# EAGLE design ssrv2 (EAGLE 5.06)
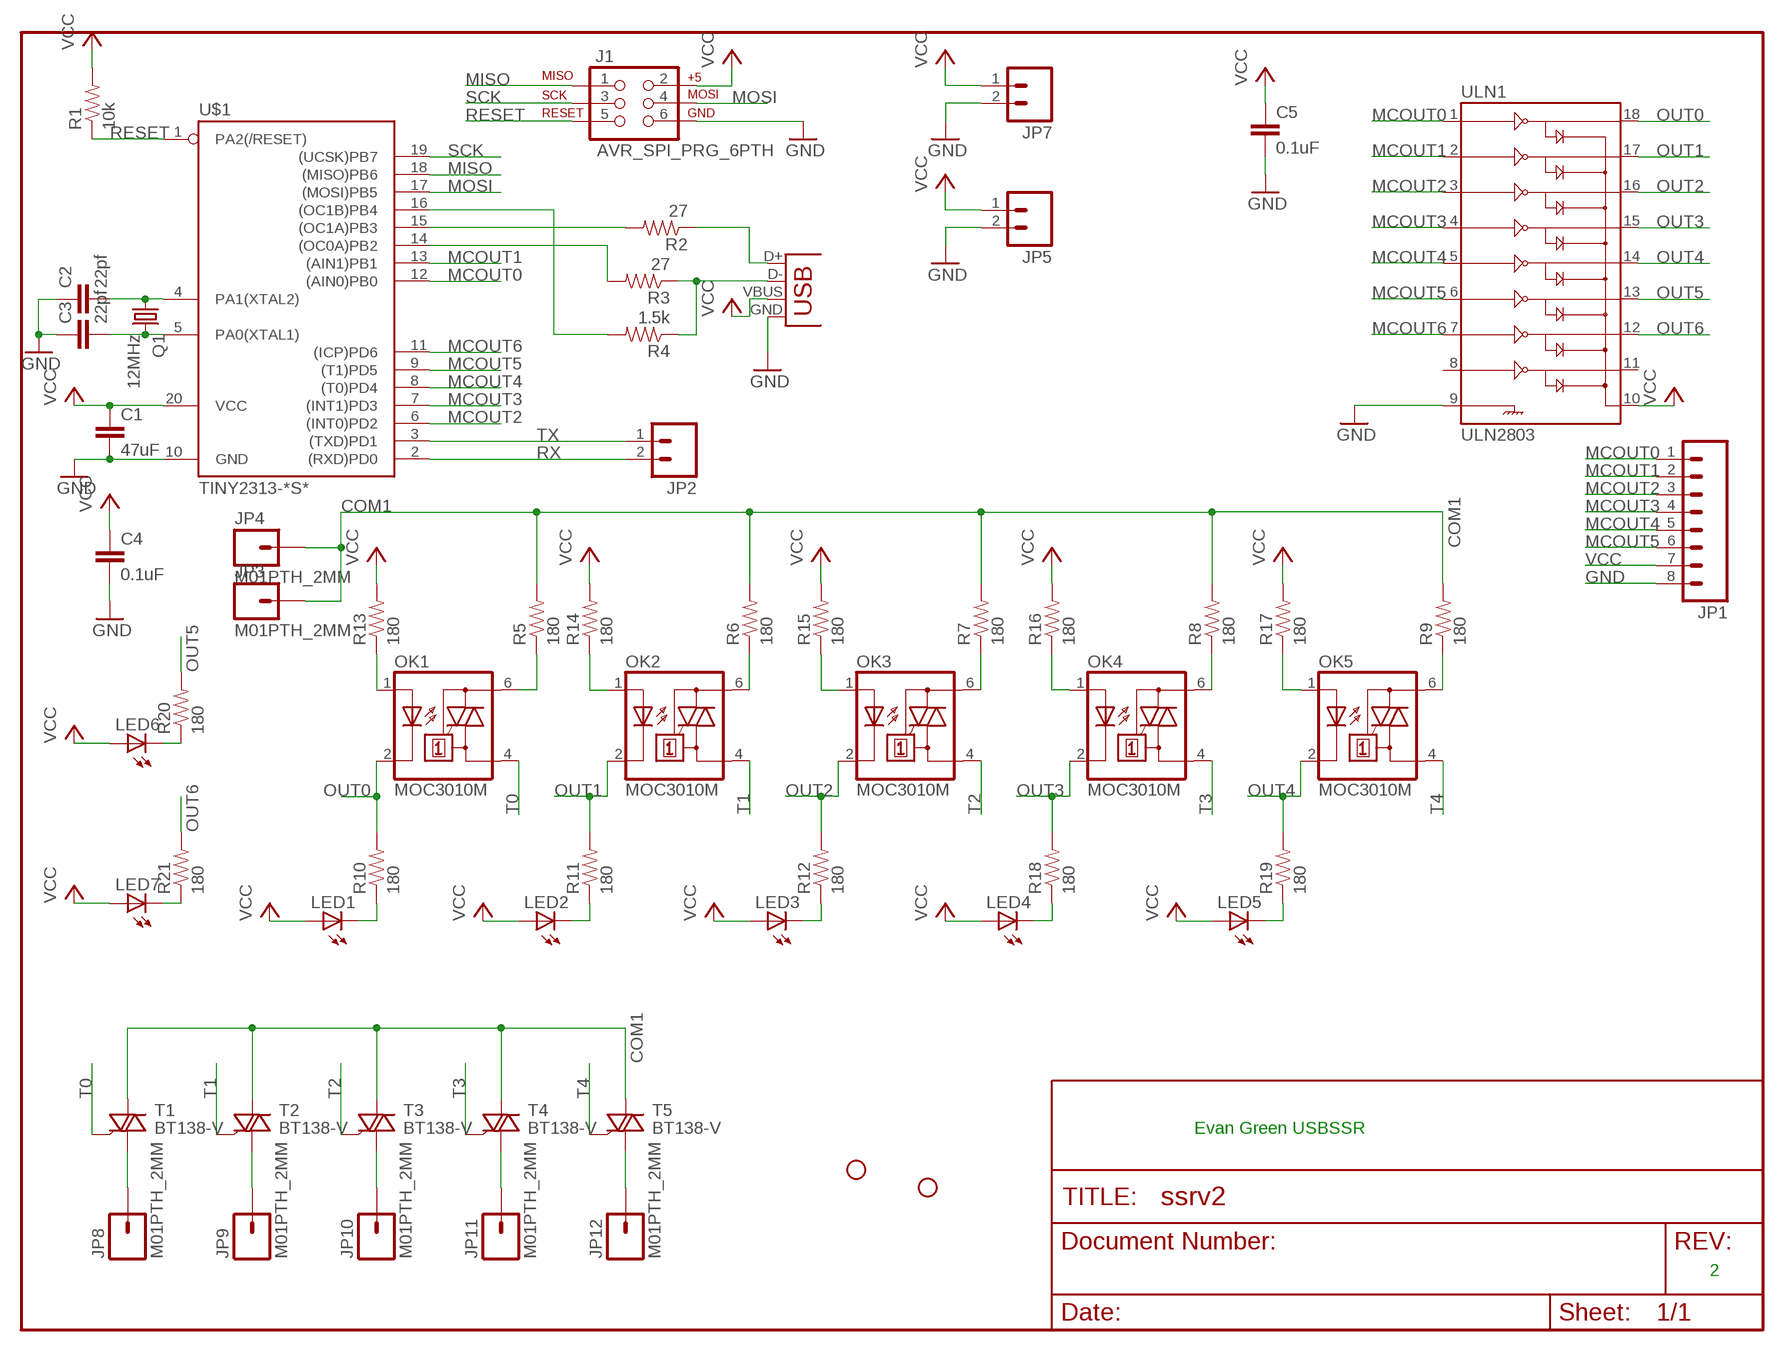
[diagram p0: schematic, sheet 1]

## Parts
C1  47uF  CAP1210  [1210]
C2  22pf  CAP0402-CAP  [0402-CAP]
C3  22pf  CAP0402-CAP  [0402-CAP]
C4  0.1uF  CAP0402-CAP  [0402-CAP]
C5  0.1uF  CAP0402-CAP  [0402-CAP]
J1  AVR_SPI_PRG_6PTH  [2X3]
JP1  M08LOCK  [1X08_LOCK]
JP2  M02PTH  [1X02]
JP3  M01PTH_2MM  [1X01_2MM]
JP4  M01PTH_2MM  [1X01_2MM]
JP5  M02PTH  [1X02]
JP6  STAND-OFF  [STAND-OFF]
JP7  M02PTH  [1X02]
JP8  M01PTH_2MM  [1X01_2MM]
JP9  M01PTH_2MM  [1X01_2MM]
JP10  M01PTH_2MM  [1X01_2MM]
JP11  M01PTH_2MM  [1X01_2MM]
JP12  M01PTH_2MM  [1X01_2MM]
JP13  STAND-OFF  [STAND-OFF]
LED1  LED1206  [LED-1206]
LED2  LED1206  [LED-1206]
LED3  LED1206  [LED-1206]
LED4  LED1206  [LED-1206]
LED5  LED1206  [LED-1206]
LED6  LED1206  [LED-1206]
LED7  LED1206  [LED-1206]
OK1  MOC3010M  [DIL06]
OK2  MOC3010M  [DIL06]
OK3  MOC3010M  [DIL06]
OK4  MOC3010M  [DIL06]
OK5  MOC3010M  [DIL06]
Q1  12MHz  CRYSTALTC38H  [TC38H]
R1  10k  RESISTOR0402-RES  [0402-RES]
R2  27  RESISTOR0402-RES  [0402-RES]
R3  27  RESISTOR0402-RES  [0402-RES]
R4  1.5k  RESISTOR0402-RES  [0402-RES]
R5  180  RESISTORPTH1  [AXIAL-0.3]
R6  180  RESISTORPTH1  [AXIAL-0.3]
R7  180  RESISTORPTH1  [AXIAL-0.3]
R8  180  RESISTORPTH1  [AXIAL-0.3]
R9  180  RESISTORPTH1  [AXIAL-0.3]
R10  180  RESISTOR0402-RES  [0402-RES]
R11  180  RESISTOR0402-RES  [0402-RES]
R12  180  RESISTOR0402-RES  [0402-RES]
R13  180  RESISTOR0402-RES  [0402-RES]
R14  180  RESISTOR0402-RES  [0402-RES]
R15  180  RESISTOR0402-RES  [0402-RES]
R16  180  RESISTOR0402-RES  [0402-RES]
R17  180  RESISTOR0402-RES  [0402-RES]
R18  180  RESISTOR0402-RES  [0402-RES]
R19  180  RESISTOR0402-RES  [0402-RES]
R20  180  RESISTOR0402-RES  [0402-RES]
R21  180  RESISTOR0402-RES  [0402-RES]
T1  BT138-V  [TO220BV]
T2  BT138-V  [TO220BV]
T3  BT138-V  [TO220BV]
T4  BT138-V  [TO220BV]
T5  BT138-V  [TO220BV]
U$1  TINY2313-*S*  [SO20L$]
ULN1  ULN2803  ULN2803SOICW  [SO18L]
X1  USBSMD  [USB-MINIB]

## Nets
COM1 [AC]: JP3.1 JP4.1 R5.P$2 R6.P$2 R7.P$2 R8.P$2 R9.P$2 T1.T2(A2) T2.T2(A2) T3.T2(A2) T4.T2(A2) T5.T2(A2)
GND: C1.2 C2.1 C3.1 C4.2 C5.2 J1.6 JP1.8 JP5.2 JP7.2 U$1.10(GND) ULN1.9 X1.GND
MCOUT0: JP1.1 U$1.12((AIN0)PB0) ULN1.1
MCOUT1: JP1.2 U$1.13((AIN1)PB1) ULN1.2
MCOUT2: JP1.3 U$1.6((INT0)PD2) ULN1.3
MCOUT3: JP1.4 U$1.7((INT1)PD3) ULN1.4
MCOUT4: JP1.5 U$1.8((T0)PD4) ULN1.5
MCOUT5: JP1.6 U$1.9((T1)PD5) ULN1.6
MCOUT6: U$1.11((ICP)PD6) ULN1.7
MISO: J1.1 U$1.18((MISO)PB6)
MOSI: J1.4 U$1.17((MOSI)PB5)
N$1: OK1.1(A) R13.1
N$2: OK2.1(A) R14.1
N$3: OK3.1(A) R15.1
N$4: OK4.1(A) R16.1
N$5: OK5.1(A) R17.1
N$6: LED5.C R19.1
N$7: LED4.C R18.1
N$8: LED3.C R12.1
N$9: OK1.6(A2) R5.P$1
N$10: OK2.6(A2) R6.P$1
N$11: OK3.6(A2) R7.P$1
N$12: OK4.6(A2) R8.P$1
N$13: OK5.6(A2) R9.P$1
N$14: LED2.C R11.1
N$15: LED1.C R10.1
N$17: R2.1 X1.D+
N$18: R2.2 U$1.15((OC1A)PB3)
N$19: R3.1 R4.1 X1.D-
N$20: R3.2 U$1.14((OC0A)PB2)
N$21 [AC]: JP8.1 T1.T1(A1)
N$22: R4.2 U$1.16((OC1B)PB4)
N$23 [AC]: JP9.1 T2.T1(A1)
N$24 [AC]: JP10.1 T3.T1(A1)
N$25 [AC]: JP11.1 T4.T1(A1)
N$26 [AC]: JP12.1 T5.T1(A1)
N$27: LED6.C R20.1
N$29: LED7.C R21.1
N$38: C2.2 Q1.1 U$1.4(PA1(XTAL2))
N$39: C3.2 Q1.2 U$1.5(PA0(XTAL1))
OUT0: OK1.2(C) R10.2 ULN1.18
OUT1: OK2.2(C) R11.2 ULN1.17
OUT2: OK3.2(C) R12.2 ULN1.16
OUT3: OK4.2(C) R18.2 ULN1.15
OUT4: OK5.2(C) R19.2 ULN1.14
OUT5: R20.2 ULN1.13
OUT6: R21.2 ULN1.12
RESET: J1.5 R1.1 U$1.1(PA2(/RESET))
RX: JP2.2 U$1.2((RXD)PD0)
SCK: J1.3 U$1.19((UCSK)PB7)
T0: OK1.4(A1) T1.G
T1: OK2.4(A1) T2.G
T2: OK3.4(A1) T3.G
T3: OK4.4(A1) T4.G
T4: OK5.4(A1) T5.G
TX: JP2.1 U$1.3((TXD)PD1)
VCC: C1.1 C4.1 C5.1 J1.2 JP1.7 JP5.1 JP7.1 LED1.A LED2.A LED3.A LED4.A LED5.A LED6.A LED7.A R1.2 R13.2 R14.2 R15.2 R16.2 R17.2 U$1.20(VCC) ULN1.10 X1.VBUS
Unconnected: ULN1.8 ULN1.11

## Notes on the sheet
- Evan Green USBSSR
- 2

## Library data of the parts
C1-C5 = SparkFun:CAP: Capacitor Standard 0603 ceramic capacitor, and 0.1" leaded capacitor.
J1 = SparkFun:AVR_SPI_PRG_6: AVR ISP 6 Pin This is the reduced ISP connector for AVR programming. Common on Arduino. This footprint will take up less PCB space and can be used with a 10-pin to 6-pin adapter such as SKU: BOB-08508
JP1 = SparkFun:M08: Header 8 Standard 8-pin 0.1" header. Use with straight break away headers (SKU : PRT-00116), right angle break away headers (PRT-00553), swiss pins (PRT-00743), machine pins (PRT-00117), and female headers (PRT-00115).
JP2 JP5 JP7 = SparkFun:M02: Header 2 Standard 2-pin 0.1" header. Use with straight break away headers (SKU : PRT-00116), right angle break away headers (PRT-00553), swiss pins (PRT-00743), machine pins (PRT-00117), and female headers (PRT-00115). Molex polarized connector foot print use with SKU : PRT-08233 with associated crimp pins and housings.
JP3 JP4 JP8-JP12 = SparkFun:M01: Header 1 Standard 1-pin 0.1" header. Use with straight break away headers (SKU : PRT-00116), right angle break away headers (PRT-00553), swiss pins (PRT-00743), machine pins (PRT-00117), and female headers (PRT-00115).
JP6 JP13 = SparkFun:STAND-OFF: Stand Off This is the mechanical footprint for a #4 phillips button head screw. Use the keepout ring to avoid running the screw head into surrounding components. SKU : PRT-00447
LED1-LED7 = SparkFun:LED: LEDs Standard schematic elements and footprints for 5mm, 3mm, 1206, and 0603 sized LEDs. 5mm - Spark Fun Electronics SKU : COM-00529 (and others)
OK1-OK5 = optocoupler:MOC30*M: RANDOM-PHASE OPTOISOLATORS TRIAC DRIVER OUTPUT Source: http://www.fairchildsemi.com MOC3020-M.pdf
Q1 = SparkFun:CRYSTAL: Crystals Various standard crystals. Proven footprints. Spark Fun Electronics SKU : COM-00534
R1-R21 = SparkFun:RESISTOR: Resistor Basic schematic elements and footprints for 0603, 1206, and PTH 1/10th watt (small) resistors.
T1-T5 = triac:BT138: TRIAC Source: http://www.semiconductors.philips.com BT138_SERIES_2.pdf
U$1 = avr-6:TINY2313*: Atmel Tiny2313 2K Flash, 128 bytes EEPROM, 128 bytes RAM
ULN1 = SparkFun:ULN2803: Darlington Driver ULN2803 Darlington array. 500mA max per channel, 8-channel package. Spark Fun Electronics SKU : COM-00312
X1 = SparkFun:USB: USB Connectors USB-B-PTH is fully proven SKU : PRT-00139 USB-miniB is fully proven SKU : PRT-00587 USB-A-PCB is untested. USB-A-H is throughly reviewed, but untested. Spark Fun Electronics SKU : PRT-00437 USB-B-SMT is throughly reviewed, but untested. Needs silkscreen touching up. USB-A-S has not been used/tested USB-MB-H has not been used/tested

## Net classes
0 default: width 0.305 mm, clearance 0.203 mm
1 AC: width 1.524 mm, clearance 0.508 mm

## Board
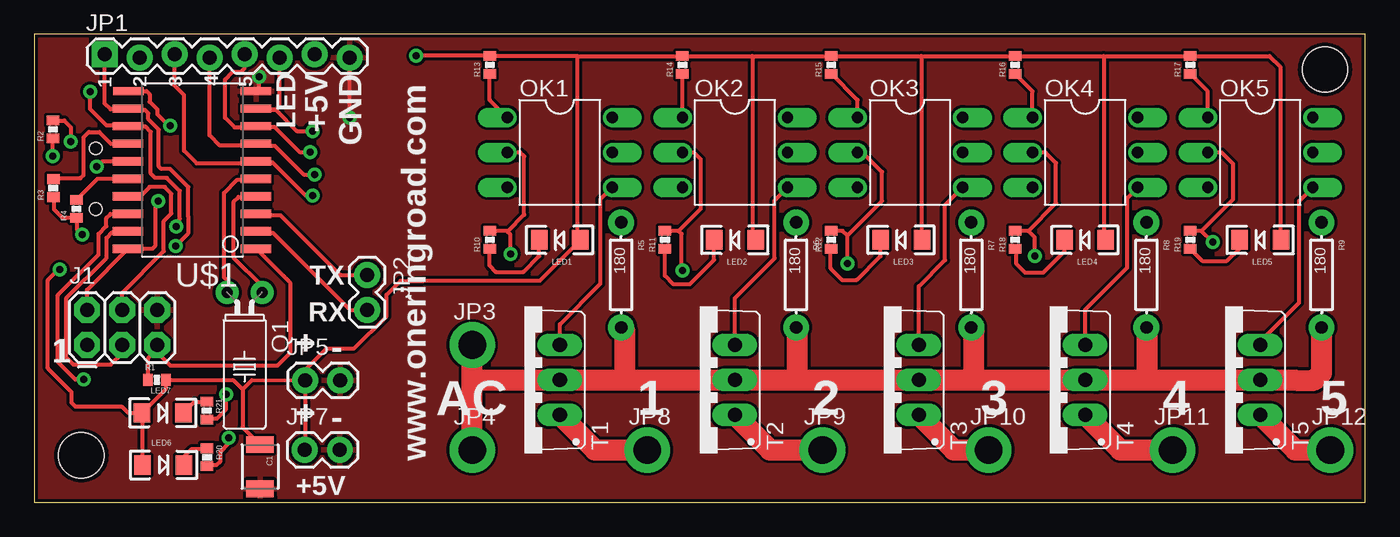
[diagram p1: board, top side]
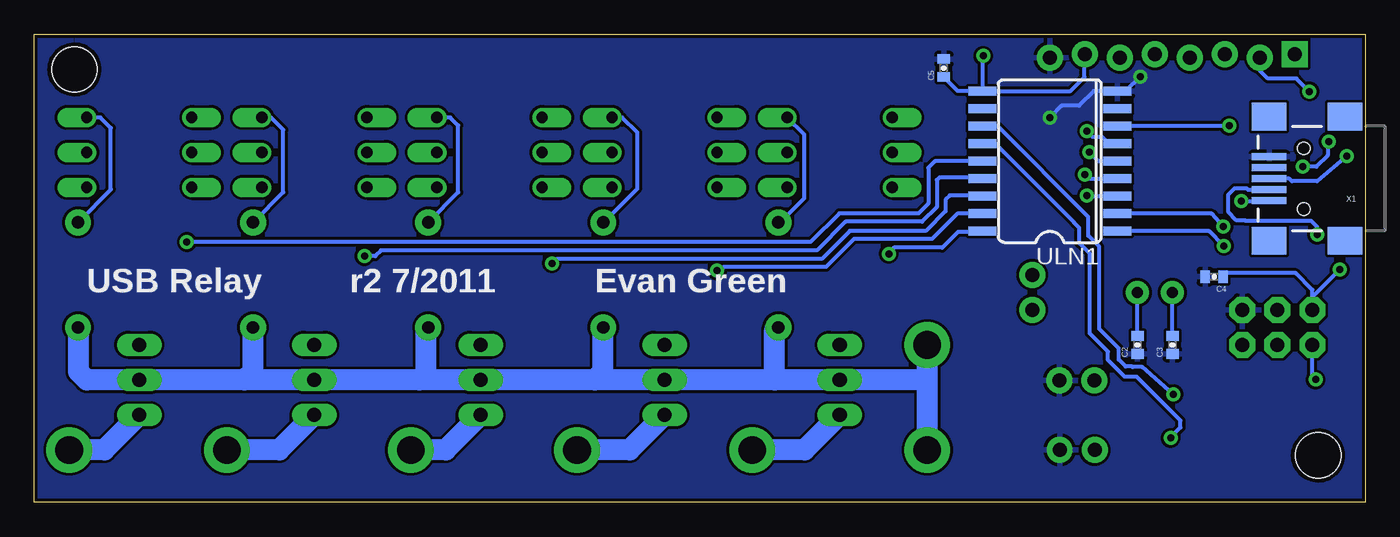
[diagram p2: board, bottom side, seen from below]

Size 96.5 x 33.96 mm. Coordinates in mm from the lower left corner, seen from the top.
Outline: 0,0 96.5,0 96.5,33.96 0,33.96 0,0
Copper layers (1*16): Top 0.035mm / dielectric 1.5mm / Bottom 0.035mm
Design rules "SparkFun": minimum track width 8mil, minimum drill 20mil, track to track 8mil, track to pad 8mil, pad to pad 8mil, via to via 8mil, smd to smd 8mil, copper to edge 10mil, drill to drill 8mil, minimum pad ring 12mil, minimum via ring 10mil, stop-mask expansion 4mil, vias tented up to drill 25mil, thermal gap 10mil

### Footprints (pad centres in the part's own frame; a part is rotated, then mirrored left to right if it is on the bottom)
1210 = smd 1.2 x 2: 1 -1.6,0; 2 1.6,0
0402-CAP = smd 0.7 x 0.9: 1 -0.65,0; 2 0.65,0
2X3 = drill 1.016 pad 1.88 octagon: 1 0,0; 2 0,2.54; 3 2.54,0; 4 2.54,2.54; 5 5.08,0; 6 5.08,2.54
1X08_LOCK = drill 1.016 pad 1.88 square: 1 0,0.127 | drill 1.016 pad 1.88 round: 2 2.54,-0.127; 3 5.08,0.127; 4 7.62,-0.127; 5 10.16,0.127; 6 12.7,-0.127; 7 15.24,0.127; 8 17.78,-0.127
1X02 = drill 1.016 pad 1.88 round: 1 0,0; 2 2.54,0
1X01_2MM = drill 2 pad 3.302 round: 1 0,0
STAND-OFF = hole 3.302: 0,0
LED-1206 = smd 1.2 x 1.4: A -1.5,0; C 1.5,0
DIL06 = drill 0.813 offset: 1 -2.54,-3.81; 2 0,-3.81; 3 2.54,-3.81; 4 2.54,3.81; 5 0,3.81; 6 -2.54,3.81
TC38H = drill 0.813 pad 1.676 round: 1 -1.27,0; 2 1.27,0
0402-RES = smd 0.7 x 0.9: 1 -0.65,0; 2 0.65,0
AXIAL-0.3 = drill 0.9 pad 1.88 round: P$1 -3.81,0; P$2 3.81,0
TO220BV = drill 1.016 long: G 2.54,-2.54; T1 -2.54,-2.54; T2 0,-2.54
SO20L$ = smd 0.61 x 2.21: 1 -5.715,-4.636; 2 -4.445,-4.636; 3 -3.175,-4.636; 4 -1.905,-4.636; 5 -0.635,-4.636; 6 0.635,-4.636; 7 1.905,-4.636; 8 3.175,-4.636; 9 4.445,-4.636; 10 5.715,-4.636; 11 5.715,4.61; 12 4.445,4.636; 13 3.175,4.636; 14 1.905,4.636; 15 0.635,4.636; 16 -0.635,4.636; 17 -1.905,4.636; 18 -3.175,4.636; 19 -4.445,4.636; 20 -5.715,4.636
SO18L = smd 0.66 x 2.032: 1 -0.635,-4.902; 2 0.635,-4.902; 3 1.905,-4.902; 4 3.175,-4.902; 5 4.445,-4.902; 6 5.715,-4.902; 7 6.985,-4.902; 8 8.255,-4.902; 9 9.525,-4.902; 10 9.525,4.902; 11 8.255,4.902; 12 6.985,4.902; 13 5.715,4.902; 14 4.445,4.902; 15 3.175,4.902; 16 1.905,4.902; 17 0.635,4.902; 18 -0.635,4.902
USB-MINIB = smd 2.5 x 0.5: D+ 2.5,0; D- 2.5,0.8; GND 2.5,-1.6; ID 2.5,-0.8; VBUS 2.5,1.6 | smd 2.5 x 2: GND@1 -3,-4.5; GND@2 -3,4.5; GND@3 2.5,4.5; GND@4 2.5,-4.5 | hole 0.9: 0,2.2; 0,-2.2

### Placement (x,y rotation side)
C1  16.36,2.59 270 top
C2  16.51,11.43 90 bottom
C3  13.97,11.43 90 bottom
C4  10.95,16.38 180 bottom
C5  30.56,31.52 90 bottom
J1  3.81,11.43 0 top
JP1  5.08,32.38 0 top
JP2  24.13,16.51 270 top
JP3  31.75,11.43 0 top
JP4  31.75,3.81 0 top
JP5  19.63,8.86 0 top
JP6  3.4,3.4 0 top
JP7  19.61,3.81 0 top
JP8  44.45,3.81 0 top
JP9  57.15,3.81 0 top
JP10  69.22,3.81 0 top
JP11  82.55,3.81 0 top
JP12  93.98,3.81 0 top
JP13  93.6,31.42 0 top
LED1  38.1,19.05 180 top
LED2  50.8,19.05 180 top
LED3  62.87,19.05 180 top
LED4  76.2,19.05 180 top
LED5  88.9,19.05 180 top
LED6  9.35,2.72 0 top
LED7  9.3,6.5 0 top
OK1  38.1,25.4 270 top
OK2  50.8,25.4 270 top
OK3  63.5,25.4 270 top
OK4  76.2,25.4 270 top
OK5  88.9,25.4 270 top
Q1  15.24,15.24 180 top
R1  8.89,8.89 0 top
R2  1.35,27.08 90 top
R3  1.37,22.81 90 top
R4  3.05,21.31 90 top
R5  42.55,16.51 270 top
R6  55.24,16.51 270 top
R7  67.94,16.51 270 top
R8  80.64,16.51 270 top
R9  93.34,16.51 270 top
R10  33.02,19.05 90 top
R11  45.72,19.05 90 top
R12  57.78,19.05 90 top
R13  33.02,31.75 90 top
R14  46.99,31.75 90 top
R15  57.78,31.75 90 top
R16  71.12,31.75 90 top
R17  83.82,31.75 90 top
R18  71.12,19.05 90 top
R19  83.82,19.05 90 top
R20  12.52,3.28 270 top
R21  12.5,6.65 270 top
T1  35.56,8.89 90 top
T2  48.26,8.89 90 top
T3  61.59,8.89 90 top
T4  73.66,8.89 90 top
T5  86.36,8.89 90 top
U$1  11.43,24.13 90 top
ULN1  22.86,20.32 90 bottom
X1  4.45,23.5 180 bottom

### Tracks (layer width: path | path; a pad name or v marks a point on that pad's centre or on a via)
COM1
  Top 1.524: JP4.1 31.75,8.89 | 31.75,8.89 JP3.1 | 31.75,8.89 T1.T2 42.82,8.89 | 42.82,8.89 T2.T2 55.35,8.89 | 55.35,8.89 T3.T2 68.15,8.89 | 68.15,8.89 T4.T2 80.72,8.89 | 80.72,8.89 T5.T2 91.44,8.89 91.47,8.87 92.81,8.87 93.34,9.4 R9.P$2 | R8.P$2 80.72,12.62 80.72,8.89 | R7.P$2 68.15,12.5 68.15,8.89 | R6.P$2 55.35,12.6 55.35,8.89 | R5.P$2 42.82,12.42 42.82,8.89
  Bottom 1.524: JP4.1 31.75,8.89 | 31.75,8.89 JP3.1 | 31.75,8.89 42.82,8.89 | 42.82,8.89 55.88,8.89 | 55.88,8.89 68.58,8.89 | 68.58,8.89 81.28,8.89 | 81.28,8.89 92.71,8.89 93.29,9.47 93.29,12.65 | 42.82,8.89 42.82,12.52 | 55.88,8.89 55.27,9.5 55.27,12.62 | 68.58,8.89 68.1,9.37 68.1,12.72 | 81.28,8.89 80.64,9.53 80.64,12.62
GND  (via drill 0.51)
  Top 0.305: U$1.10 16.31,30.09 v16.31,30.91 | v22.86,27.94 JP1.8
  Bottom 0.305: v16.31,30.91 17.37,29.84 ULN1.9 19.68,29.84 20.75,28.78 22.02,28.78 v22.86,27.94
  pour Top: 0,0 96.52,0 96.52,34.29 0,34.29
  pour Bottom: 0,0 96.52,0 96.52,34.29 0,34.29
MCOUT0  (via drill 0.51)
  Top 0.305: JP1.1 5.08,28.96 5.51,28.52 6.74,28.52 U$1.12 6.9,28.47 8.03,28.47 8.26,28.25 8.26,27.81 9.02,27.05 9.02,24.38 9.2,24.21 9.83,24.21 11.15,22.89 11.15,20.73 11.18,20.7 11.18,19.56 v10.24,18.62
  Bottom 0.305: v10.24,18.62 11.3,19.68 ULN1.1
MCOUT1  (via drill 0.51)
  Top 0.305: v4.04,29.82 4.04,28.55 5.23,27.36 6.74,27.36 U$1.13 6.84,27.25 8.05,27.25 8.43,26.87 8.43,23.85 8.74,23.55 9.6,23.55 10.54,22.61 10.54,20.57 10.19,20.22 v10.26,20.02
  Bottom 0.305: v4.04,29.82 4.98,30.76 7.04,30.76 7.62,31.34 JP1.2 | v10.26,20.02 11.12,20.95 ULN1.2
MCOUT2  (via drill 0.51)
  Top 0.305: v20.17,22.28 19.66,22.28 17.27,24.66 16.17,24.66 U$1.6 15.91,24.61 11.76,24.61 10.85,25.53 10.85,29.57 10.16,30.25 JP1.3
  Bottom 0.305: v20.17,22.28 20.12,22.23 ULN1.3
MCOUT3  (via drill 0.51)
  Top 0.305: v20.32,23.8 19.51,23.8 17.42,25.88 16.22,25.88 U$1.7 15.96,25.93 13.41,25.93 12.7,26.64 JP1.4
  Bottom 0.305: v20.32,23.8 20.02,23.5 ULN1.4
MCOUT4  (via drill 0.51)
  Top 0.305: v19.99,25.43 19.23,25.43 17.4,27.25 16.12,27.25 U$1.8 15.99,27.23 14.5,27.23 13.82,27.91 13.82,30.68 14.38,31.24 14.99,31.24 15.24,31.5 JP1.5
  Bottom 0.305: v19.99,25.43 19.33,24.77 ULN1.5
MCOUT5  (via drill 0.51)
  Top 0.305: v20.17,26.95 19.02,26.95 17.48,28.5 16.14,28.5 U$1.9 16.09,28.55 17.55,28.55 17.78,28.78 JP1.6
  Bottom 0.305: v20.17,26.95 19.76,26.54 19.07,26.54 18.57,26.04 ULN1.6
MCOUT6  (via drill 0.51)
  Top 0.305: U$1.11 8.13,29.84 8.36,29.62 8.36,29.08 8.91,28.52 8.91,28.17 9.7,27.38 v9.86,27.33
  Bottom 0.305: v9.86,27.33 9.75,27.3 ULN1.7
MISO  (via drill 0.51)
  Top 0.305: U$1.18 6.77,20.93 5.51,20.93 5.21,20.62 5.21,20.04 4.65,19.48 4.65,17.98 1.7,15.04 1.7,10.19 2.97,8.91 v3.58,8.91
  Bottom 0.305: v3.58,8.91 3.81,9.14 J1.1
MOSI
  Top 0.305: U$1.17 6.9,22.33 7.8,22.33 8.36,22.89 9.45,22.89 9.93,22.4 9.93,20.98 9.37,20.42 9.37,18.24 6.35,15.21 J1.4
N$1
  Top 0.305: OK1.1 33.02,29.21 R13.1
N$2
  Top 0.305: OK2.1 R14.1
N$3
  Top 0.305: R15.1 59.69,29.2 OK3.1
N$4
  Top 0.305: R16.1 72.39,29.83 OK4.1
N$5
  Top 0.305: R17.1 85.09,29.83 OK5.1
N$6
  Top 0.305: R19.1 84.69,17.53 86.49,17.53 87.4,18.44 LED5.C
N$7
  Top 0.305: R18.1 71.22,18.3 71.22,17.3 71.86,16.66 73.15,16.66 74.7,18.21 LED4.C
N$8
  Top 0.305: R12.1 57.73,18.35 57.73,16.99 58.57,16.15 59.64,16.15 61.37,17.88 LED3.C
N$9
  Bottom 0.305: OK1.6 40.66,26.7 40.66,22.07 42.42,20.32 R5.P$1
N$10
  Bottom 0.305: R6.P$1 52.78,22.78 52.78,26.85 53.87,27.94 OK2.6
N$11
  Bottom 0.305: R7.P$1 65.76,22.5 65.76,27.36 66.34,27.94 OK3.6
N$12
  Bottom 0.305: R8.P$1 78.46,22.5 78.46,27.05 79.35,27.94 OK4.6
N$13
  Bottom 0.305: R9.P$1 90.96,22.71 90.96,27.18 91.72,27.94 OK5.6
N$14
  Top 0.305: R11.1 45.72,16.46 46.35,15.82 47.52,15.82 49.3,17.6 LED2.C
N$15
  Top 0.305: R10.1 32.99,18.38 32.99,17.2 33.45,16.74 35.46,16.74 36.6,17.88 LED1.C
N$17  (via drill 0.51)
  Top 0.305: R2.1 1.32,26.4 v1.32,25.15
  Bottom 0.305: v1.32,25.15 3.48,23.32 5.31,23.32 5.49,23.5 X1.D+
N$18  (via drill 0.51)
  Top 0.305: R2.2 1.36,27.71 2.16,27.71 2.64,27.23 v2.64,26.19 | v4.52,24.36 4.93,24.77 U$1.15
  Bottom 0.305: v2.64,26.19 2.72,26.11 2.72,25.17 3.53,24.36 v4.52,24.36
N$19  (via drill 0.51)
  Top 0.305: R3.1 1.4,22.13 1.4,21.29 2.02,20.66 R4.1 3.07,20.64 3.07,19.81 3.45,19.43 v3.48,19.43
  Bottom 0.305: X1.D- 8.5,22.7 8.61,22.81 9.45,22.81 9.91,22.35 9.91,21.06 9.32,20.47 8.71,20.47 8.66,20.42 3.91,20.42 3.48,19.99 v3.48,19.43
N$20
  Top 0.305: R3.2 1.43,23.52 3.33,23.52 3.56,23.75 3.56,26.49 3.94,26.87 4.7,26.87 5.54,26.04 U$1.14
N$21
  Top 1.524: T1.T1 40.64,3.81 JP8.1
  Bottom 1.524: T1.T1 40.64,3.81 JP8.1
N$22
  Top 0.305: R4.2 4.58,23.5 U$1.16
N$23
  Top 1.524: T2.T1 53.34,3.81 JP9.1
  Bottom 1.524: T2.T1 53.34,3.81 JP9.1
N$24
  Top 1.524: T3.T1 66.67,3.81 JP10.1
  Bottom 1.524: T3.T1 66.67,3.81 69.85,3.81
N$25
  Top 1.524: T4.T1 78.74,3.81 JP11.1
  Bottom 1.524: T4.T1 78.74,3.81 JP11.1
N$26
  Top 1.524: T5.T1 91.44,3.81 JP12.1
  Bottom 1.524: T5.T1 91.44,3.81 JP12.1
N$27
  Top 0.305: R20.1 12.48,3.89 11.4,3.89 10.85,3.33 LED6.C
N$29
  Top 0.305: LED7.C 11.6,7.3 R21.1
N$38
  Top 0.305: U$1.4 16.02,22.17 14.81,22.17 14.45,21.82 14.45,17.75 16.51,15.7 Q1.1
  Bottom 0.305: C2.2 Q1.1
N$39
  Top 0.305: U$1.5 15.99,23.42 14.71,23.42 13.74,22.45 13.74,16.33 13.97,16.1 Q1.2
  Bottom 0.305: C3.2 Q1.2
OUT0  (via drill 0.51)
  Top 0.305: v34.54,18.03 34.52,18.06 34.52,19.43 34.25,19.7 | 34.25,19.7 R10.2 | OK1.2 35.23,25.4 35.51,25.12 35.51,20.88 34.33,19.7 34.25,19.7
  Bottom 0.305: ULN1.18 27.81,19.63 29.52,19.63 30.66,18.49 34.16,18.49 34.54,18.11 v34.54,18.03
OUT1  (via drill 0.51)
  Top 0.305: v46.99,16.82 46.94,16.87 46.94,19.48 46.72,19.7 | 46.72,19.7 R11.2 | 46.72,19.7 48.34,21.32 48.34,24.89 47.83,25.4 OK2.2
  Bottom 0.305: ULN1.17 29.57,20.95 31.39,19.13 37.06,19.13 39.09,17.09 46.51,17.09 46.79,16.82 v46.99,16.82
OUT2  (via drill 0.51)
  Top 0.305: v58.98,17.35 58.95,17.53 58.95,19.36 | 58.95,19.36 58.61,19.7 R12.2 | 58.95,19.36 61.47,21.87 61.47,23.98 60.05,25.4 OK3.2
  Bottom 0.305: ULN1.16 27.81,22.28 30.12,22.28 30.43,21.97 30.43,21.13 31.85,19.71 37.36,19.71 39.4,17.68 58.57,17.68 58.75,17.5 v58.98,17.35
OUT3  (via drill 0.51)
  Top 0.305: v72.57,17.88 72.54,17.91 72.54,19.23 72.07,19.7 | 72.07,19.7 R18.2 | 72.07,19.7 74.09,21.72 74.09,24.64 73.33,25.4 OK4.2
  Bottom 0.305: ULN1.15 27.84,23.57 30.89,23.57 31.06,23.39 31.06,21.44 32.13,20.37 37.67,20.37 39.75,18.29 71.37,18.29 71.78,17.88 v72.57,17.88
OUT4  (via drill 0.51)
  Top 0.305: v85.45,18.9 84.64,19.7 | 84.64,19.7 R19.2 | 84.64,19.7 86.94,22 86.94,24.56 86.11,25.4 OK5.2
  Bottom 0.305: ULN1.14 31.19,24.77 31.67,24.28 31.67,21.69 32.38,20.98 38.12,20.98 40.21,18.9 v85.45,18.9
OUT5  (via drill 0.51)
  Top 0.305: R20.2 12.61,2.72 13.21,2.72 13.49,3 13.49,3.68 14.1,4.29 v14.1,4.67
  Bottom 0.305: ULN1.13 26.8,26.04 21.11,20.34 21.11,20.3 20.73,19.91 20.73,18.82 19.96,18.06 19.96,12.27 18.64,10.95 18.64,10.34 17.42,9.12 16.56,9.12 13.39,5.94 13.39,5.44 14.1,4.72 v14.1,4.67
OUT6  (via drill 0.51)
  Top 0.305: R21.2 12.59,6.1 13.23,6.1 13.89,6.76 v13.89,7.85
  Bottom 0.305: ULN1.12 26.64,27.3 20.07,20.73 20.07,19.36 19.28,18.57 19.28,12.6 17.86,11.18 17.86,10.36 17.35,9.86 16.89,9.86 16.87,9.83 16.15,9.83 v13.89,7.85
RESET
  Top 0.305: U$1.1 18.57,15.91 18.57,10.87 17.63,9.93 9.86,9.93 8.89,10.9 | 8.89,10.9 J1.5 | R1.1 8.26,8.9 8.26,10.49 8.66,10.9 8.89,10.9
RX
  Top 0.305: U$1.2 16.17,19.58 17.27,19.58 22.89,13.97 JP2.2
SCK
  Top 0.305: U$1.19 6.72,19.61 5.64,19.61 5.23,19.2 5.23,17.75 2.31,14.83 2.31,10.52 2.82,10.01 5.54,10.01 6.35,10.82 J1.3
T0
  Top 0.305: OK1.4 41.05,22 41.05,15.88 38.1,12.93 T1.G
T1
  Top 0.305: OK2.4 53.67,21.92 53.67,17.7 50.8,14.83 T2.G
T2
  Top 0.305: OK3.4 66.04,21.59 66.04,17.58 64.14,15.67 T3.G
T3
  Top 0.305: OK4.4 79.25,22.1 79.25,17.04 76.2,13.99 T4.G
T4
  Top 0.305: OK5.4 91.72,21.87 91.72,14.5 88.9,11.68 T5.G
TX
  Top 0.305: U$1.3 16.17,20.85 17.83,20.85 22.17,16.51 JP2.1
VCC  (via drill 0.51)
  Top 0.305: v8.97,21.87 8.79,21.82 8.79,18.64 8.56,18.41 U$1.20 3.81,15.43 J1.2 | 39.37,32.4 R13.2 v27.69,32.41 | 39.37,32.4 R14.2 52.07,32.4 | 52.07,32.4 R15.2 64.31,32.4 | 64.31,32.4 R16.2 77.55,32.4 | 77.55,32.4 R17.2 89.57,32.4 90.35,31.62 90.35,19.1 LED5.A | 39.37,32.4 39.37,19.28 LED1.A 36.65,16.1 28.22,16.1 28.19,16.08 26.54,16.08 25.53,15.06 25.53,13.51 23.19,11.18 21.18,11.18 19.63,9.63 JP5.1 | LED2.A 52.07,19.28 52.07,32.4 | LED3.A 64.31,19.1 64.31,32.4 | LED4.A 77.55,19.2 77.55,32.4 | v1.83,16.89 1.73,16.89 0.96,16.13 0.96,9.73 2.69,8 2.69,7.24 2.97,6.96 6.33,6.96 6.78,6.5 LED7.A | 15.09,8.2 14.4,8.89 R1.2 9.54,8.25 LED7.A | 15.09,8.2 15.77,8.89 JP5.1 | JP7.1 19.63,3.83 JP5.1 | LED6.A 7.8,2.77 LED7.A | C1.1 15.09,5.46 15.09,8.2
  Bottom 0.305: X1.VBUS 6.97,21.87 v8.97,21.87 | v1.83,16.89 3.81,14.91 J1.2 3.81,15.43 5.02,16.64 10.04,16.64 C4.1 | JP1.7 20.34,32.49 20.34,30.86 21.36,29.84 ULN1.10 | v27.69,32.41 27.76,32.33 ULN1.10 | C5.1 29.53,29.84 ULN1.10

### Text on the board
tPlace: LED | +5V | GND | 1 | 2 | 3 | 4 | 5 | www.oneringroad.com | TX | RX | + | 1 | - | AC | 1 | 2 | 3 | 4 | 5 | + | - | +5V
bPlace: Evan Green | r2 7/2011 | USB Relay